# EAGLE design SilentStepStick-TMC2208_v12 (EAGLE 7.7.0)
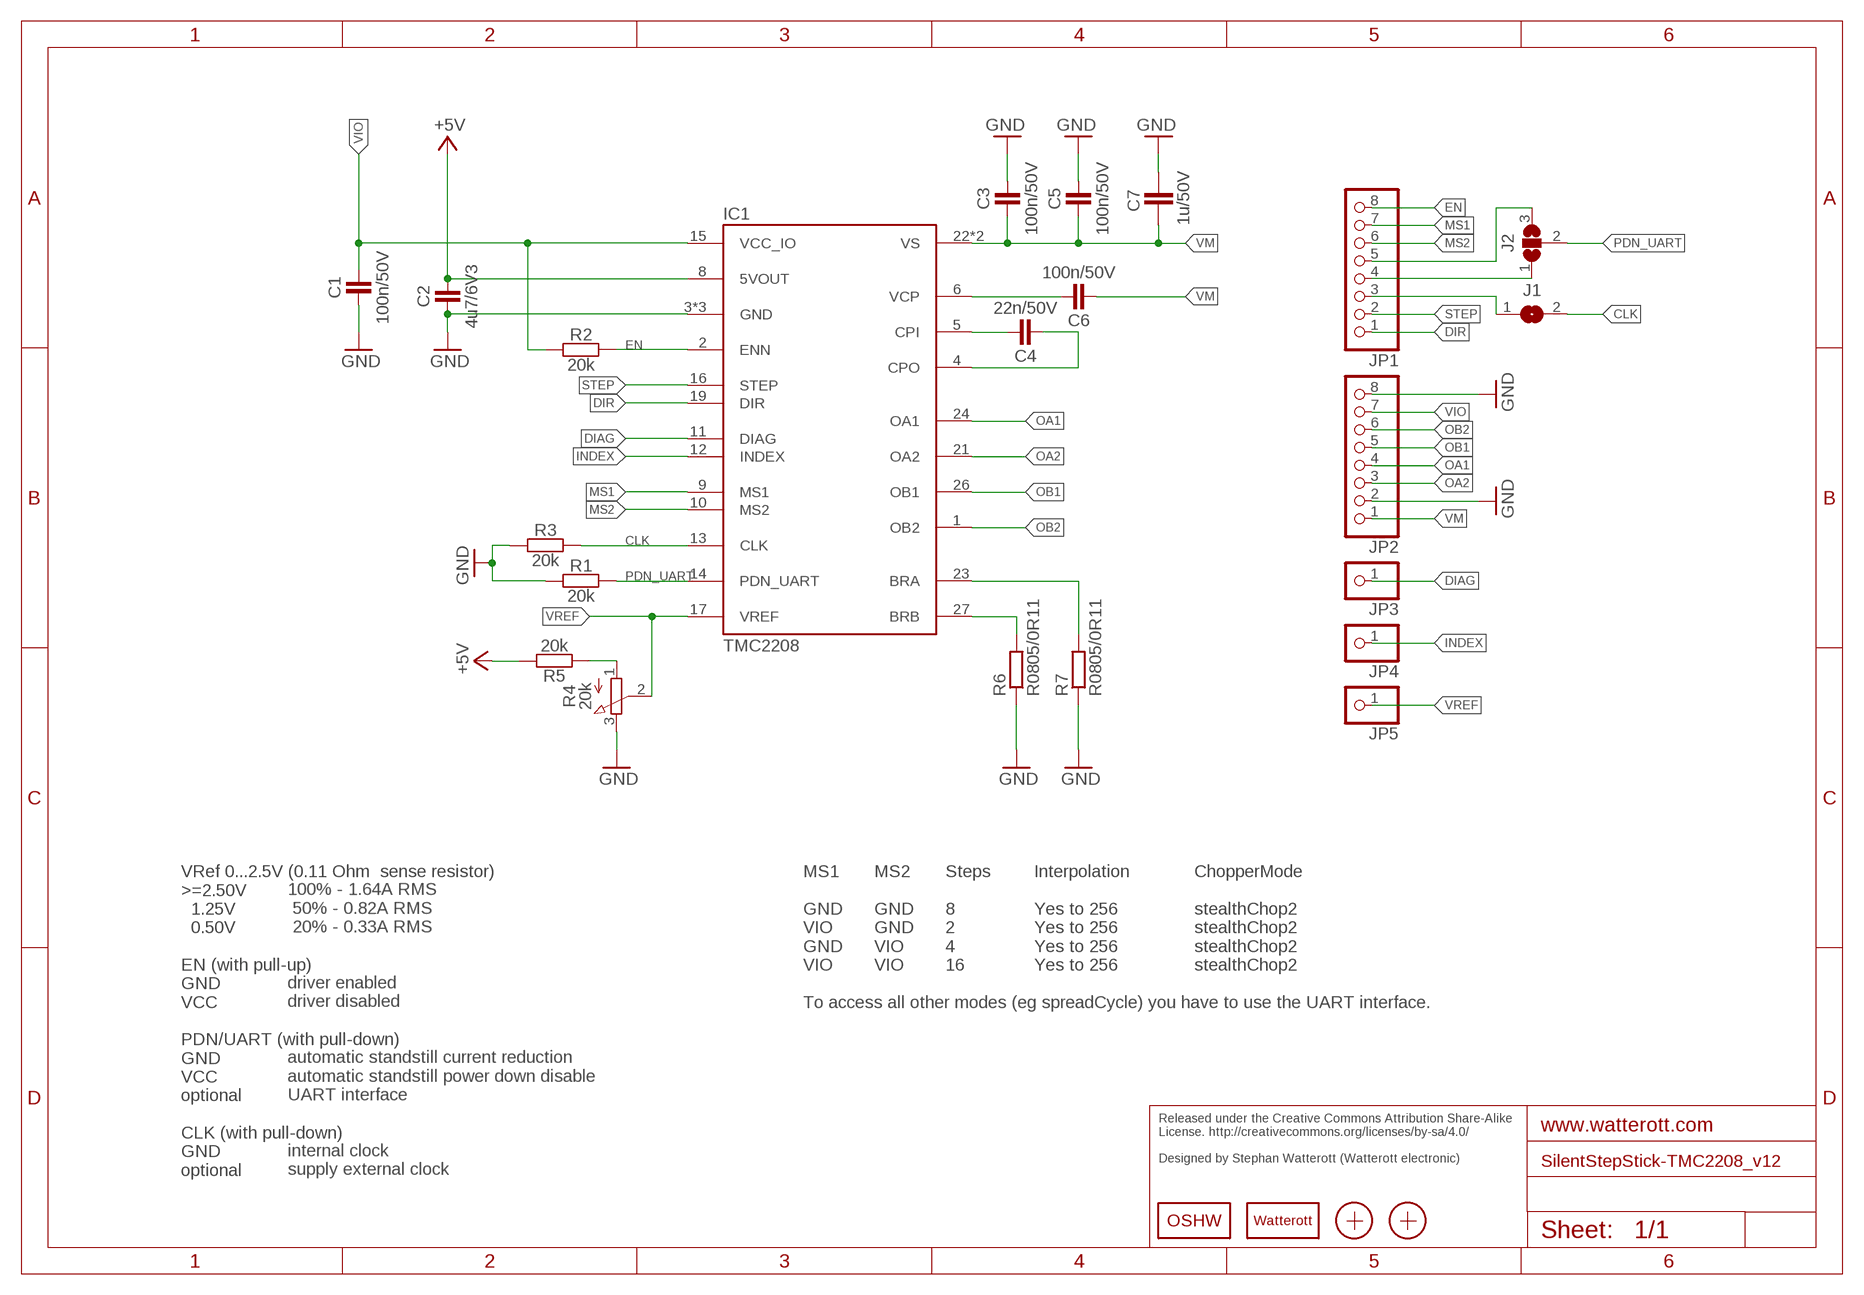
[diagram p0: schematic, sheet 1]

## Parts
C1  100n/50V  CAPACITOR-0402  [C0402]
C2  4u7/6V3  CAPACITOR-0402  [C0402]
C3  100n/50V  CAPACITOR-0402  [C0402]
C4  22n/50V  CAPACITOR-0402  [C0402]
C5  100n/50V  CAPACITOR-0402  [C0402]
C6  100n/50V  CAPACITOR-0402  [C0402]
C7  1u/50V  C-EUC0805  [C0805]
IC1  TMC2208  [QFN28-PAD]
J1  JUMPER2-0402  [JUMPER2-0402]
J2  JUMPER3-0402-NC  [JUMPER3-0402_NC]
JP1  PINHD-1X08_2.54-S  [1X08-S]
JP2  PINHD-1X08_2.54-S  [1X08-S]
JP3  PINHD-1X1  [1X01]
JP4  PINHD-1X1  [1X01]
JP5  PINHD-1X1  [1X01]
LOGO1  OSHW_LOGOX0070  [OSHW_6X70]
LOGO2  LOGO-S_PLACE_M  [SPARK_TPLACE_M]
R1  20k  RESISTOR-0402  [C0402]
R2  20k  RESISTOR-0402  [C0402]
R3  20k  RESISTOR-0402  [C0402]
R4  20k  POT-EVM3R  [POT_EVM3R]
R5  20k  RESISTOR-0402  [C0402]
R6  R0805/0R11  R-EU_M0805  [M0805]
R7  R0805/0R11  R-EU_M0805  [M0805]
X1  PASSER-04  [PASSER_04MM]
X2  PASSER-04  [PASSER_04MM]

## Nets
+5V: C2.2 IC1.8(5VOUT) R5.2
BRA: IC1.23(BRA) R7.2
BRB: IC1.27(BRB) R6.2
CLK: IC1.13(CLK) J1.2 R3.2
CPI: C4.2 IC1.5(CPI)
CPO: C4.1 IC1.4(CPO)
DIAG: IC1.11(DIAG) JP3.1
DIR: IC1.19(DIR) JP1.1
EN: IC1.2(ENN) JP1.8 R2.2
GND: C1.1 C2.1 C3.2 C5.2 C7.2 IC1.3(GND) IC1.18(GND) IC1.TP(GND) JP2.2 JP2.8 R1.1 R3.1 R4.3(E) R6.1 R7.1
INDEX: IC1.12(INDEX) JP4.1
MS1: IC1.9(MS1) JP1.7
MS2: IC1.10(MS2) JP1.6
N$1: J2.3 JP1.5
N$2: J1.1 JP1.3
N$3: J2.1 JP1.4
OA1: IC1.24(OA1) JP2.4
OA2: IC1.21(OA2) JP2.3
OB1: IC1.26(OB1) JP2.5
OB2: IC1.1(OB2) JP2.6
PDN_UART: IC1.14(PDN_UART) J2.2 R1.2
STEP: IC1.16(STEP) JP1.2
VCP: C6.2 IC1.6(VCP)
VIO: C1.2 IC1.15(VCC_IO) JP2.7 R2.1
VM: C3.1 C5.1 C6.1 C7.1 IC1.22(VS) IC1.28(VS) JP2.1
VREF: IC1.17(VREF) JP5.1 R4.2(S)
VREF1: R4.1(A) R5.1

## Notes on the sheet
- VRef 0...2.5V (0.11 Ohm  sense resistor)
  >=2.50V
    1.25V
    0.50V
  
  EN (with pull-up)
  GND
  VCC
  
  PDN/UART (with pull-down)
  GND
  VCC
  optional
  
  CLK (with pull-down)
  GND
  optional
- MS1
  
  GND
  VIO
  GND
  VIO
  
  To access all other modes (eg spreadCycle) you have to use the UART interface.
- MS2
  
  GND
  GND
  VIO
  VIO
- Steps
  
  8
  2
  4
  16
- Interpolation
  
  Yes to 256
  Yes to 256
  Yes to 256
  Yes to 256
- ChopperMode
  
  stealthChop2
  stealthChop2
  stealthChop2
  stealthChop2
- 100% - 1.64A RMS
   50% - 0.82A RMS
   20% - 0.33A RMS
  
  
  driver enabled
  driver disabled
  
  
  automatic standstill current reduction
  automatic standstill power down disable
  UART interface
  
  
  internal clock
  supply external clock
- Released under the Creative Commons Attribution Share-Alike 
  License. http://creativecommons.org/licenses/by-sa/4.0/
  
  Designed by Stephan Watterott (Watterott electronic)

## Library data of the parts
C1-C6 = we-rcl:CAPACITOR: Capacitors ...2.2uF @ 6.3V -> 0402 ...4.7uF @ 6.3V -> 0603 ...10uF @ 16V -> 0805 ...22uF @ 25V -> 1206
C7 = rcl:C-EU: CAPACITOR, European symbol
IC1 = we-chip:TMC2208: Trinamic TMC2108 Stepper Motor Driver (5V...36V, 1.2A RMS, 256 microsteps)
J1 = we-rcl:JUMPER2: 2 Pin Jumpers
J2 = we-rcl:JUMPER3: 3 Pin Jumpers
JP1 JP2 = pinhead-2:PINHD-1X08: PIN HEADER
JP3-JP5 = pinhead:PINHD-1X1: PIN HEADER
LOGO1 = we-symbol:OSHW_LOGO: Open-Source-Hardware Logo
LOGO2 = we-symbol:LOGO: Watterott electronic Logo
R1-R3 R5 = we-rcl:RESISTOR: Resistors all kinds in 0402 and 0603
R4 = we-rcl:POT: Potentiometer
R6 R7 = rcl:R-EU_: RESISTOR, European symbol
X1 X2 = we-symbol:PASSER: Fiducial Markers

## Board
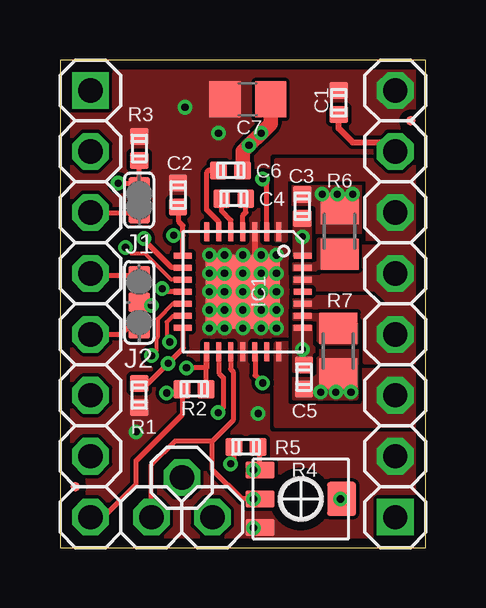
[diagram p1: board, top side]
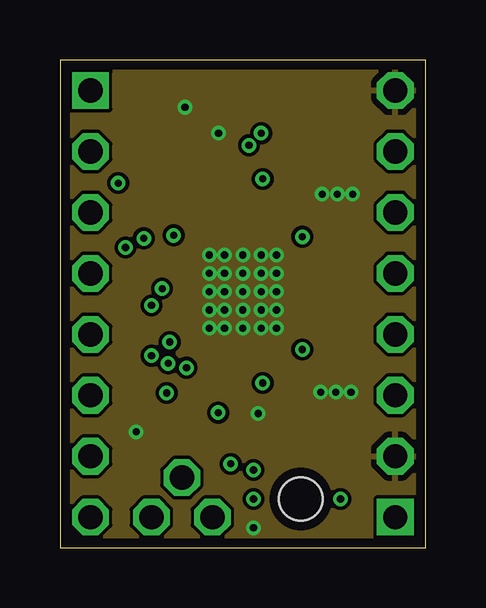
[diagram p2: board, inner layer Ground]
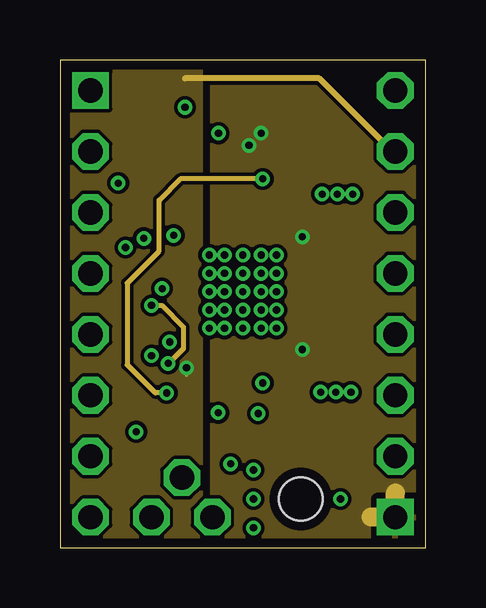
[diagram p3: board, inner layer Supply]
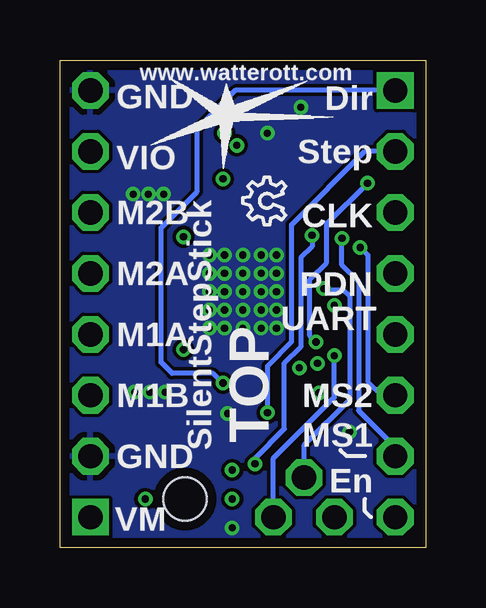
[diagram p4: board, bottom side, seen from below]

Size 15.24 x 20.32 mm. Coordinates in mm from the lower left corner, seen from the top.
Outline: 0,0 15.24,0 15.24,20.32 0,20.32 0,0
Copper layers (1+2*15+16): Top 0.035mm / dielectric 0.35mm / Ground 0.035mm / dielectric 0.76mm / Supply 0.035mm / dielectric 0.35mm / Bottom 0.035mm
Design rules "Default_WE_Euro *": minimum track width 0.15mm, minimum drill 0.25mm, track to track 0.15mm, track to pad 0.15mm, pad to pad 0.15mm, via to via 0.15mm, smd to smd 0mil, copper to edge 0.4mm, drill to drill 8mil, minimum pad ring 10mil, minimum via ring 6mil, stop-mask expansion 2mil, vias tented up to drill 0.5mm, thermal gap 10mil

### Footprints (pad centres in the part's own frame; a part is rotated, then mirrored left to right if it is on the bottom)
C0402 = smd 0.75 x 0.7: 1 0,0.5; 2 0,-0.5
C0805 = smd 1.3 x 1.5: 1 -0.95,0; 2 0.95,0
QFN28-PAD = smd 0.8 x 0.26: 1 -2.5,1.5; 2 -2.5,1; 3 -2.5,0.5; 4 -2.5,0; 5 -2.5,-0.5; 6 -2.5,-1; 7 -2.5,-1.5; 15 2.5,-1.5; 16 2.5,-1; 17 2.5,-0.5; 18 2.5,0; 19 2.5,0.5; 20 2.5,1; 21 2.5,1.5 | smd 0.26 x 0.8: 8 -1.5,-2.5; 9 -1,-2.5; 10 -0.5,-2.5; 11 0,-2.5; 12 0.5,-2.5; 13 1,-2.5; 14 1.5,-2.5; 22 1.5,2.5; 23 1,2.5; 24 0.5,2.5; 25 0,2.5; 26 -0.5,2.5; 27 -1,2.5; 28 -1.5,2.5 | smd 3.1 x 3.1: TP 0,0
JUMPER2-0402 = smd 0.9 x 0.8: 1 0,0.55; 2 0,-0.55
JUMPER3-0402_NC = smd 0.9 x 0.8: 1 0,1.1; 2 0,0; 3 0,-1.1
1X08-S = drill 1.016 square: 1 -8.89,0 | drill 1.016 octagon: 2 -6.35,0; 3 -3.81,0; 4 -1.27,0; 5 1.27,0; 6 3.81,0; 7 6.35,0; 8 8.89,0
1X01 = drill 1.016 octagon: 1 0,0
POT_EVM3R = smd 0.7 x 1.2: 1 -1.2,-1.7; 2 0,-1.7; 3 1.2,-1.7 | smd 1.4 x 1.2: MOUNT 0,1.7 | hole 1.8: 0,0
M0805 = smd 1.3 x 1.6: 1 -0.95,0; 2 0.95,0
PASSER_04MM = smd 0.4 x 0.4: X 0,0

### Placement (x,y rotation side)
C1  11.61,18.54 0 top
C2  4.92,14.7 0 top
C3  10.1,14.22 180 top
C4  7.24,14.54 270 top
C5  10.16,7.11 0 top
C6  7.11,15.72 270 top
C7  7.83,18.68 180 top
IC1  7.62,10.67 270 top
J1  3.3,14.48 180 top
J2  3.3,10.22 0 top
JP1  1.27,10.16 270 top
JP2  13.97,10.16 90 top
JP3  5.08,2.92 0 top
JP4  6.35,1.27 0 top
JP5  3.81,1.27 0 top
LOGO1  5.84,13.46 90 bottom
LOGO2  8.26,18.03 0 bottom
R1  3.3,6.35 180 top
R2  5.59,6.6 270 top
R3  3.3,16.64 0 top
R4  10.03,2.03 270 top
R5  7.75,4.19 270 top
R6  11.65,13.18 270 top
R7  11.59,8.2 90 top
X1  0.64,2.54 0 top
X2  14.61,17.78 0 top

### Tracks (layer width: path | path; a pad name or v marks a point on that pad's centre or on a via)
+5V  (via drill 0.3)
  Top 0.2: IC1.8 5.12,13.02 | 5.12,13.02 5.12,13.42 4.95,13.59 4.95,14.17 C2.2 | R5.2 7.25,3.63 v7.11,3.49 | 5.12,13.02 v4.74,13.02
  Bottom 0.2: 4.57,13.02 v4.74,13.02 4.74,12.55 5.21,12.08 5.21,8.38 5.89,7.7 5.89,4.95 7.11,3.73 v7.11,3.49
BRA
  pour Top (rank 3, no thermals): 9.78,9.78 12.32,9.78 12.32,8.51 10.92,8.51 10.79,8.64 10.79,9.53 9.78,9.53
BRB
  pour Top (rank 2, no thermals): 9.78,11.81 10.67,11.81 10.79,11.81 10.79,12.83 12.32,12.83 12.32,11.68 10.79,11.68 10.67,11.56 9.78,11.56
CLK  (via drill 0.3)
  Top 0.17: IC1.13 4.84,9.67 | 4.83,9.65 4.7,9.65 4.45,9.4 4.45,8.7 v4.57,8.57
  Top 0.2: J1.2 3.3,15.24 | 3.3,15.24 R3.2 | 4.84,9.67 4.83,9.65 | v2.43,15.19 3.25,15.19 3.3,15.24
  Bottom 0.2: v4.57,8.57 4.83,8.83 4.83,11.18 4.13,11.87 4.13,13.49 v2.43,15.19
CPI
  Top 0.2: IC1.5 7.12,13.64 6.73,14.03 C4.2
CPO
  Top 0.2: IC1.4 7.62,13.84 7.75,13.97 C4.1
DIAG  (via drill 0.3)
  Top 0.2: IC1.11 4.38,10.67 v4.25,10.79
  Bottom 0.2: JP3.1 5.08,4.27 3.17,6.17 3.17,10.49 3.43,10.74 4.2,10.74 v4.25,10.79
DIR  (via drill 0.3)
  Top 0.2: IC1.19 8.13,7.18 v8.45,6.86
  Bottom 0.2: JP1.1 7.94,19.05 9.53,17.46 9.53,14.83 11.02,13.34 11.02,7.72 10.57,7.26 8.87,7.26 v8.46,6.86 v8.45,6.86
EN  (via drill 0.3)
  Top 0.2: IC1.2 8.62,15.19 v8.45,15.37 | v4.45,6.45 4.92,6.45 | 4.92,6.45 R2.2 | JP1.8 1.8,1.27 3.17,2.64 3.17,3.63 5.11,5.56 5.11,6.26 4.92,6.45
  Supply 0.2: v8.45,15.37 5.02,15.37 4.13,14.48 4.13,12.36 2.79,11.02 2.79,7.62 3.97,6.45 v4.45,6.45
GND  (via drill 0.3)
  Top 0.254: IC1.3 8.12,11.69 8.13,11.68
  other vias: 10.86,6.48 12.13,6.48 12.19,14.73 10.92,14.73 3.17,4.83 6.22,12.19 6.86,12.19 7.62,12.19 8.38,12.19 9.02,12.19 6.22,11.43 6.86,11.43 7.62,11.43 8.38,11.43 9.02,11.43 6.22,10.67 6.86,10.67 7.62,10.67 8.38,10.67 9.02,10.67 6.22,9.91 6.86,9.91 7.62,9.91 8.38,9.91 9.02,9.91 6.22,9.14 6.86,9.14 7.62,9.14 8.38,9.14 9.02,9.14 6.6,17.27 8.26,5.59 5.21,18.35 11.49,6.48 11.56,14.73 8.06,0.83
  pour Top (rank 3, no thermals): 9.78,7.11 10.79,7.11 10.79,7.87 12.32,7.87 12.32,6.22 9.78,6.22
  pour Top (rank 4, no thermals): 9.78,14.35 10.79,14.35 10.79,13.46 12.45,13.46 12.45,14.99 9.78,14.99
  pour Top (rank 6, no thermals): 0,0 15.24,0 15.24,20.32 0,20.32
  pour Ground: 0,20.32 15.24,20.32 15.24,0 0,0
  pour Bottom: 0,0 15.24,0 15.24,20.32 0,20.32
INDEX  (via drill 0.3)
  Top 0.17: IC1.12 4.7,10.16 4.06,9.53 4.06,8.76 4,8.7 4,8.19 v3.81,8
  Top 0.2: IC1.12
  Bottom 0.2: v3.81,8 3.81,6.26 6.35,3.72 JP4.1
MOUNT  (via drill 0.3)
  other vias: 11.68,2.03
MS1  (via drill 0.3)
  Top 0.2: IC1.9 4.65,11.67 3.49,12.83 v3.49,12.89
  Bottom 0.2: v3.49,12.89 3.49,11.77 2.79,11.07 2.79,5.71 1.27,4.19 JP1.7
MS2  (via drill 0.3)
  Top 0.17: IC1.10 4.64,11.17 3.56,12.26 2.98,12.26 v2.73,12.51
  Bottom 0.2: v2.73,12.51 2.41,12.19 2.41,6.92 1.84,6.35 JP1.6
N$1
  Top 0.2: JP1.5 2.54,8.89 2.79,9.14 3.28,9.14 J2.3
N$2
  Top 0.2: J1.1 1.31,13.93 JP1.3
N$3
  Top 0.2: 1.35,11.35 JP1.4 1.38,11.32 J2.1
OA1
  pour Top (rank 2, no thermals): 9.78,10.03 12.19,10.03 12.7,9.53 12.7,7.75 15.24,7.75 15.24,10.03 13.46,10.03 12.95,10.54 9.78,10.54
OA2
  pour Top (rank 5, no thermals): 9.53,8.51 9.53,5.97 12.7,5.97 12.7,7.49 15.24,7.49 15.24,5.08 9.02,5.08 9.02,8.51
OB1
  pour Top (no thermals): 9.78,11.24 9.78,10.79 13.14,10.79 13.59,10.35 15.24,10.35 15.24,12.51 11.81,12.51 11.05,11.43 10.86,11.24
OB2
  pour Top (rank 5, no thermals): 9.02,12.83 9.4,12.83 9.4,15.37 12.83,15.37 12.83,12.83 15.24,12.83 15.24,16.13 9.02,16.13
PDN_UART  (via drill 0.3)
  Top 0.2: R1.2 3.67,6.85 v4.51,7.68 5.14,8.32 5.14,9.14 IC1.14 | J2.2 3.68,10.22 v3.81,10.1
  Supply 0.2: v4.51,7.68 4.53,7.68 5.16,8.31 5.16,9.2 4.25,10.1 v3.81,10.1
STEP  (via drill 0.3)
  Top 0.2: IC1.16 6.62,7.27 6.81,7.09 6.81,5.84 v6.59,5.63
  Bottom 0.2: JP1.2 2.54,16.51 5.59,13.46 5.59,8.57 6.59,7.57 v6.59,5.63
VCP
  Top 0.2: IC1.6 6.62,13.57 6.1,14.1 6.1,15.62 6.19,15.72 C6.2
VIO  (via drill 0.3)
  Top 0.2: 6.1,7.49 6.1,8.14 IC1.15 6.12,7.52 6.1,7.49 | 6.1,7.49 v5.27,7.49 | R2.1 6.09,7.49 6.1,7.49
  Top 0.254: C1.2 11.61,17.47 12.19,16.89 13.59,16.89 JP2.7
  Supply 0.2: v5.27,7.49 5.27,7.24
  Supply 0.254: JP2.7 13.84,16.51 10.79,19.56 5.21,19.56
  pour Supply: 0,20.32 5.84,20.32 5.84,0 0,0
VM  (via drill 0.3)
  Top 0.61: C7.1 8.78,17.67 v8.38,17.27 v7.87,16.76 7.62,16.51 C6.1
  Supply 0.8: 12.95,1.27 JP2.1 13.97,2.29
  other vias: 10.1,8.26 10.1,12.95
  pour Top (rank 4, no thermals): 9.78,9.27 10.54,9.27 10.54,7.37 9.78,7.37
  pour Top (rank 3, no thermals): 10.41,12.19 10.41,13.97 9.78,13.97 9.78,12.19
  pour Supply: 15.24,0 15.24,20.32 6.35,20.32 6.35,0
VREF  (via drill 0.3)
  Top 0.2: IC1.17 7.11,7.44 7.21,7.34 7.21,5.31 6.35,4.45 | JP5.1 3.81,3.45 4.8,4.45 6.35,4.45 | R4.2 v8.06,2.03 7.57,2.03 6.35,3.25 6.35,4.45
VREF1  (via drill 0.3)
  Top 0.2: R5.1 8.33,4.11 R4.1 v8.06,3.24

### Text on the board
bPlace: www.watterott.com | Dir | GND | Step | VIO | CLK | M2B | PDN | M2A | UART | M1A | MS2 | M1B | MS1 | TOP | SilentStepStick | En | GND | VM
Document: Dir | GND | Step | Vio - 3.3-5V | CLK | Motor Coil 1-B | PDN/UART | Motor Coil 1-A | Motor Coil 2-A | MS2 | Motor Coil 2-B | MS1 | GND | En | Vm | VRef | DIAG | INDEX
Reference: Silkscreen: 22 bPlace